# EAGLE design stm_power_supply (EAGLE 9.5.2)
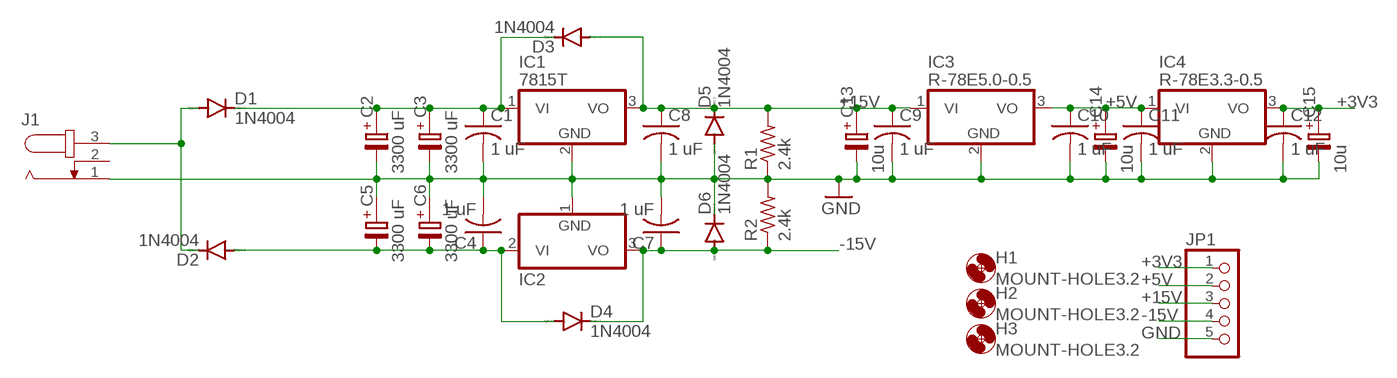
[diagram p0: schematic, sheet 1]

## Parts
C1  1 uF  C-US025-024X044  [C025-024X044]
C2  3300 uF  C-PR-7,5X18  [E7,5-18]
C3  3300 uF  C-PR-7,5X18  [E7,5-18]
C4  1 uF  C-US025-024X044  [C025-024X044]
C5  3300 uF  C-PR-7,5X18  [E7,5-18]
C6  3300 uF  C-PR-7,5X18  [E7,5-18]
C7  1 uF  C-US025-024X044  [C025-024X044]
C8  1 uF  C-US025-024X044  [C025-024X044]
C9  1 uF  C-US025-024X044  [C025-024X044]
C10  1 uF  C-US025-024X044  [C025-024X044]
C11  1 uF  C-US025-024X044  [C025-024X044]
C12  1 uF  C-US025-024X044  [C025-024X044]
C13  10u  C-PR-2,5X6  [E2,5-6]
C14  10u  C-PR-2,5X6  [E2,5-6]
C15  10u  C-PR-2,5X6  [E2,5-6]
D1  1N4004  [DO41-10]
D2  1N4004  [DO41-10]
D3  1N4004  [DO41-10]
D4  1N4004  [DO41-10]
D5  1N4004  [DO41-10]
D6  1N4004  [DO41-10]
H1  MOUNT-HOLE3.2  [3,2]
H2  MOUNT-HOLE3.2  [3,2]
H3  MOUNT-HOLE3.2  [3,2]
IC1  7815T  [TO220H]
IC2  7915T  [TO220H]
IC3  R-78E5.0-0.5  WE173950378  [WE78]
IC4  R-78E3.3-0.5  WE173950378  [WE78]
J1  JACK-PLUG0  [SPC4077]
JP1  PINHD-1X5  [1X05]
R1  2.4k  R-US_0204/7  [0204/7]
R2  2.4k  R-US_0204/7  [0204/7]

## Nets
+3V3: C12.1 C15.+ IC4.3(VO) JP1.1
+5V: C10.1 C11.1 C14.+ IC3.3(VO) IC4.1(VI) JP1.2
+15V: C8.1 C9.1 C13.+ D3.A D5.C IC1.3(VO) IC3.1(VI) JP1.3 R1.2
-15V: C7.1 D4.C D6.A IC2.3(VO) JP1.4 R2.1
GND: C1.2 C2.- C3.- C4.2 C5.+ C6.+ C7.2 C8.2 C9.2 C10.2 C11.2 C12.2 C13.- C14.- C15.- D5.A D6.C IC1.2(GND) IC2.1(GND) IC3.2(GND) IC4.2(GND) J1.1 JP1.5 R1.1 R2.2
N$1: C1.1 C2.+ C3.+ D1.C D3.C IC1.1(VI)
N$2: D1.A D2.C J1.3
N$4: C4.1 C5.- C6.- D2.A D4.A IC2.2(VI)
Unconnected: J1.2

## Library data of the parts
C1 C4 C7-C12 = rcl:C-US: CAPACITOR, American symbol; SPICEPREFIX: C
C2 C3 C5 C6 C13-C15 = cap-pan40:C-PR: POLARIZED ELECTROLYTIC/TANTALUM
D1-D6 = diode:1N4004: DIODE general purpose rectifier, 1 A
H1-H3 = holes:MOUNT-HOLE: MOUNTING HOLE with drill center marker
IC1 = linear:78*: Positive VOLTAGE REGULATOR Source: http://cache.national.com/ds/LM/LM78L05.pdf http://www.fairchildsemi.com/ds/LM/LM7805.pdf
IC2 = linear:79*: Negative VOLTAGE REGULATOR
IC3 IC4 = og-vreg:WE173950378
J1 = con-jack:JACK-PLUG: DC POWER JACK Power Jack, DC, Right Angle, Through Hole, Rated 5A at 16VDC, PC Terminals Distributor: Farnell (www.Farnell.de) Drawing: 84N1161.pdf / 84N1162.pdf Manufacturer: SPC Technology (www.spctechnology.com) Type: SPC4077 / SPC 4078
JP1 = pinhead:PINHD-1X5: PIN HEADER
R1 R2 = rcl:R-US_: RESISTOR, American symbol; SPICEPREFIX: R

## Board
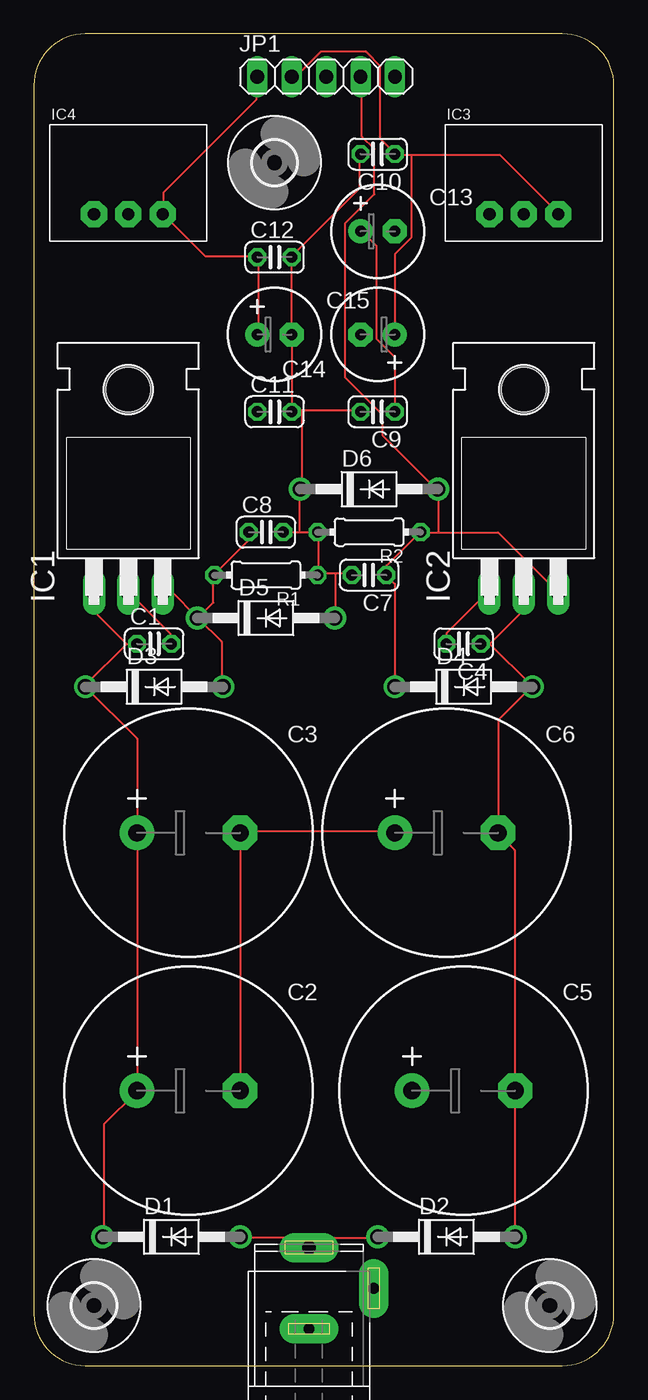
[diagram p1: board, top side]
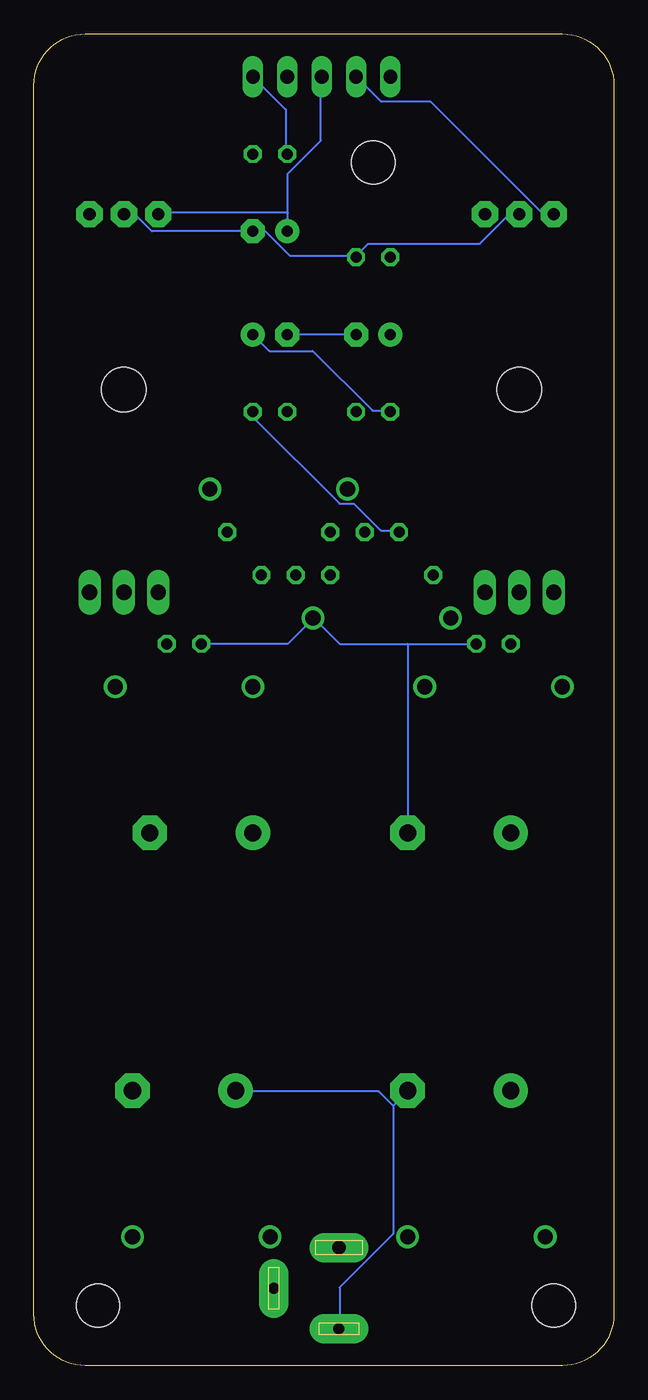
[diagram p2: board, bottom side, seen from below]

Size 42.85 x 98.42 mm. Coordinates in mm from the lower left corner, seen from the top.
Outline: 39.04,98.42 3.81,98.42 arc90 0,94.61 0,3.81 arc90 3.81,0 39.04,0 arc90 42.85,3.81 42.85,94.61 arc90 39.04,98.42
Copper layers (1*16): Top 0.035mm / dielectric 1.5mm / Bottom 0.035mm
Design rules "default": minimum track width 6mil, minimum drill 0.35mm, track to track 6mil, track to pad 6mil, pad to pad 6mil, via to via 6mil, smd to smd 6mil, copper to edge 40mil, drill to drill 6mil, minimum pad ring 10mil, minimum via ring 8mil, stop-mask expansion 4mil, vias tented up to drill 0mil, thermal gap 10mil

### Footprints (pad centres in the part's own frame; a part is rotated, then mirrored left to right if it is on the bottom)
C025-024X044 = drill 0.813 octagon: 1 -1.27,0; 2 1.27,0
E7,5-18 = drill 1.27 pad 2.54: + -3.81,0 | drill 1.27 pad 2.54 octagon: - 3.81,0
E2,5-6 = drill 0.813 pad 1.778: + -1.27,0 | drill 0.813 pad 1.778 octagon: - 1.27,0
DO41-10 = drill 1.118: A 5.08,0; C -5.08,0
3,2 = hole 3.2: 0,0
TO220H = drill 1.118 long: 1 -2.54,-10.16; 2 0,-10.16; 3 2.54,-10.16 | hole 3.302: 0,4.826
WE78 = drill 0.9 pad 1.93 octagon: 1 -2.54,0; 2 0,0; 3 2.54,0
SPC4077 = drill 0.8 pad 2.184 long: 1 -3,0; 2 0,-4.8 | drill 1 pad 2.184 long: 3 3,0
1X05 = drill 1.016 long: 1 -5.08,0; 2 -2.54,0; 3 0,0; 4 2.54,0; 5 5.08,0
0204/7 = drill 0.813 octagon: 1 -3.81,0; 2 3.81,0

### Placement (x,y rotation side)
C1  8.89,53.34 0 top
C2  11.43,20.32 0 top
C3  11.43,39.37 0 top
C4  31.75,53.34 180 top
C5  31.75,20.32 0 top
C6  30.48,39.37 0 top
C7  24.77,58.42 180 top
C8  17.14,61.59 0 top
C9  25.4,70.48 180 top
C10  25.4,89.53 180 top
C11  17.78,70.48 0 top
C12  17.78,81.92 0 top
C13  25.4,83.82 0 top
C14  25.4,76.2 180 top
C15  17.78,76.2 0 top
D1  10.16,9.53 0 top
D2  30.48,9.53 0 top
D3  8.89,50.16 0 top
D4  31.75,50.16 0 top
D5  17.14,55.24 0 top
D6  24.77,64.77 0 top
H1  4.45,4.45 0 top
H2  38.1,4.45 0 top
H3  17.78,88.9 0 top
IC1  6.99,67.31 0 top
IC2  36.2,67.31 0 top
IC3  36.2,85.09 0 top
IC4  6.99,85.09 0 top
J1  20.32,5.71 90 top
JP1  21.59,95.25 0 top
R1  17.14,58.42 180 top
R2  24.77,61.59 180 top

### Tracks (layer width: path | path; a pad name or v marks a point on that pad's centre or on a via)
+3V3
  Top 0.152: C15.+ 16.61,76.2 16.61,81.84 C12.1 16.46,81.99 12.65,81.99 9.6,85.04 IC4.3 9.6,85.19 9.6,86.72 16.46,93.57 16.46,95.25 JP1.1
+5V
  Top 0.152: 27.89,89.46 34.44,89.46 38.71,85.19 IC3.3 | 27.89,89.46 26.67,89.46 C10.1 26.67,89.61 25.6,90.68 25.6,96.01 24.54,97.08 21.18,97.08 19.36,95.25 JP1.2 | C14.+ 26.67,82.14 27.89,83.36 27.89,89.46
  Bottom 0.152: C14.+ 25.45,74.98 22.25,74.98 17.83,70.56 16.61,70.56 C11.1 | JP1.2 17.22,93.42 13.56,93.42 5.33,85.19 4.57,85.19 IC4.1
+15V
  Top 0.152: D5.C 12.19,55.32 13.26,56.39 13.26,58.37 R1.2 13.41,58.52 15.85,60.96 15.85,61.57 C8.1 | IC1.3 10.21,57.15 12.04,55.32 D5.C | D3.A 13.87,50.29 13.87,53.49 12.19,55.17 D5.C | C9.1 26.67,74.52 25.3,75.89 25.3,82.75 24.23,83.82 C13.+
  Bottom 0.152: 24.08,85.19 24.08,83.82 C13.+ | 24.08,85.19 24.08,88.09 21.64,90.53 21.64,95.25 JP1.3 | 24.08,85.19 33.53,85.19 IC3.1 | C9.1 26.67,70.1 20.27,63.7 19.2,63.7 17.22,61.72 16,61.72 C8.1
-15V
  Top 0.152: D4.C 26.67,57.76 26.06,58.37 C7.1 26.06,58.52 26.06,59.13 28.5,61.57 R2.1 28.65,61.57 29.87,61.57 | 29.87,61.57 34.29,61.57 38.71,57.15 IC2.3 | JP1.4 24.23,95.25 24.23,90.83 25.15,89.92 25.15,86.56 23.01,84.43 23.01,73 25.76,70.26 25.76,68.73 29.72,64.77 D6.A 29.87,64.77 29.87,61.57
GND
  Top 0.152: 19.81,70.56 24.08,70.56 C9.2 | 19.81,70.56 19.05,70.56 | 19.05,70.56 C15.- C12.2 19.05,81.99 24.08,87.02 24.08,89.46 C10.2 | 19.05,70.56 C11.2 | C6.+ 26.67,39.47 15.24,39.47 C3.- C2.- | C4.2 30.48,54.1 33.53,57.15 IC2.1 | C1.2 10.06,53.34 10.06,54.1 7.01,57.15 IC1.2 | 19.66,61.57 20.88,61.57 R2.2 21.03,61.57 21.03,58.52 | 19.66,61.57 18.44,61.57 C8.2 | 19.66,61.57 19.66,64.77 D6.C 19.81,64.77 19.81,70.56 | 22.25,58.52 23.47,58.52 C7.2 | 22.25,58.52 21.03,58.52 | 22.25,58.52 22.25,55.32 D5.A | 21.03,58.52 R1.1
  Bottom 0.152: JP1.5 24.23,92.81 24.23,89.61 C10.2 | C15.- C14.- | 19.05,81.99 23.93,81.99 25.76,83.82 C13.- 34.14,83.82 35.36,85.04 36.12,85.04 IC3.2 | 19.05,81.99 18.14,82.91 9.91,82.91 7.77,85.04 7.01,85.04 IC4.2 | 19.05,81.99 C12.2 | 16.31,19.2 16.31,9.75 20.27,5.79 20.27,2.74 J1.1 | 16.31,19.2 15.24,20.27 C2.- | 16.31,19.2 17.37,20.27 27.89,20.27 C5.+ | 15.24,53.34 20.27,53.34 22.1,55.17 D5.A 22.25,55.17 24.08,53.34 C4.2 | 15.24,53.34 C1.2 | 15.24,53.34 C3.-
N$1
  Top 0.152: D1.C 5.18,9.6 5.18,17.83 7.62,20.27 C2.+ C3.+ 7.62,46.33 3.81,50.14 D3.C 3.81,50.29 6.86,53.34 | 6.86,53.34 C1.1 | 6.86,53.34 4.57,55.63 4.57,57.15 IC1.1
N$2
  Top 0.152: D1.A 15.24,9.45 19.66,9.45 20.27,8.84 J1.3 20.42,8.84 21.03,9.45 25.3,9.45 D2.C
N$4
  Top 0.152: D2.A 35.51,9.6 35.51,20.27 C5.- 35.51,20.42 35.51,38.1 34.29,39.32 C6.- 34.29,47.7 36.73,50.14 D4.A 36.73,50.29 33.68,53.34 | 33.68,53.34 C4.1 | 33.68,53.34 36.12,55.78 36.12,57.15 IC2.2